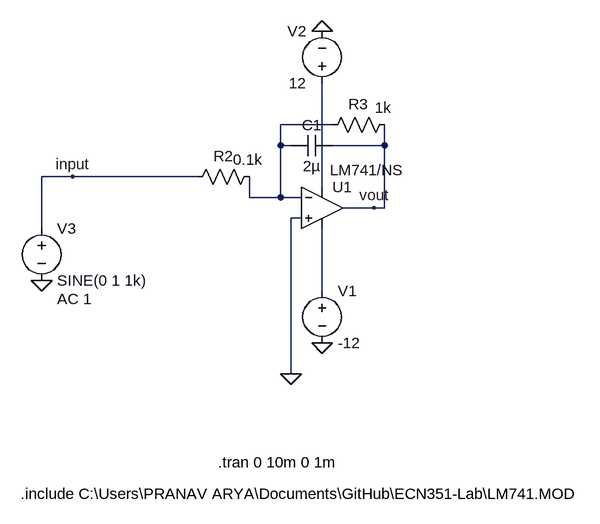
[diagram p0: schematic intigrator.asc]
intigrator.asc, the LTspice schematic file:
Version 4
SHEET 1 880 680
WIRE 112 -192 32 -192
WIRE 32 -160 32 -192
WIRE 48 -160 32 -160
WIRE 192 -160 192 -192
WIRE 192 -160 112 -160
WIRE -288 -112 -336 -112
WIRE -96 -112 -288 -112
WIRE 96 -96 96 -256
WIRE -16 -80 -16 -112
WIRE 32 -80 32 -160
WIRE 32 -80 -16 -80
WIRE 64 -80 32 -80
WIRE 176 -64 128 -64
WIRE 192 -64 192 -160
WIRE 192 -64 176 -64
WIRE 64 -48 48 -48
WIRE -336 -32 -336 -112
WIRE 96 64 96 -32
WIRE 48 192 48 -48
FLAG 96 144 0
FLAG 96 -336 0
FLAG -336 48 0
FLAG 48 192 0
FLAG 176 -64 vout
FLAG -288 -112 input
SYMBOL OpAmps\\opamp2 96 -128 R0
WINDOW 3 12 6 Left 2
SYMATTR Value LM741/NS
SYMATTR InstName U1
SYMBOL voltage 96 48 R0
WINDOW 123 0 0 Left 0
WINDOW 39 0 0 Left 0
SYMATTR InstName V1
SYMATTR Value -12
SYMBOL voltage 96 -240 R180
WINDOW 0 24 96 Left 2
WINDOW 3 24 16 Left 2
WINDOW 123 0 0 Left 0
WINDOW 39 0 0 Left 0
SYMATTR InstName V2
SYMATTR Value 12
SYMBOL res 0 -128 R90
WINDOW 0 0 56 VBottom 2
WINDOW 3 -26 18 VTop 2
SYMATTR InstName R2
SYMATTR Value 0.1k
SYMBOL voltage -336 -48 R0
WINDOW 123 24 124 Left 2
WINDOW 39 0 0 Left 0
SYMATTR Value2 AC 1
SYMATTR InstName V3
SYMATTR Value SINE(0 1 1k)
SYMBOL res 208 -208 R90
WINDOW 0 0 56 VBottom 2
WINDOW 3 -26 18 VTop 2
SYMATTR InstName R3
SYMATTR Value 1k
SYMBOL cap 112 -176 R90
WINDOW 0 0 32 VBottom 2
WINDOW 3 32 32 VTop 2
SYMATTR InstName C1
SYMATTR Value 2µ
TEXT -368 376 Left 2 !.include C:\\Users\\PRANAV ARYA\\Documents\\GitHub\\ECN351-Lab\\LM741.MOD
TEXT -64 328 Left 2 !.tran 0 10m 0 1m

The netlist it stands for:
* intigrator.asc
XU1 0 N001 N002 N003 vout LM741/NS  ; pins In+ In- V+ V- OUT
V1 N003 0 -12
V2 N002 0 12
R2 N001 input 0.1k
V3 input 0 SINE(0 1 1k) AC 1
R3 vout N001 1k
C1 vout N001 2µ
.include C:\Users\PRANAV ARYA\Documents\GitHub\ECN351-Lab\LM741.MOD
.tran 0 10m 0 1m
.backanno
.end